# Altium project Iot_Flatform_Analog.PrjPcb
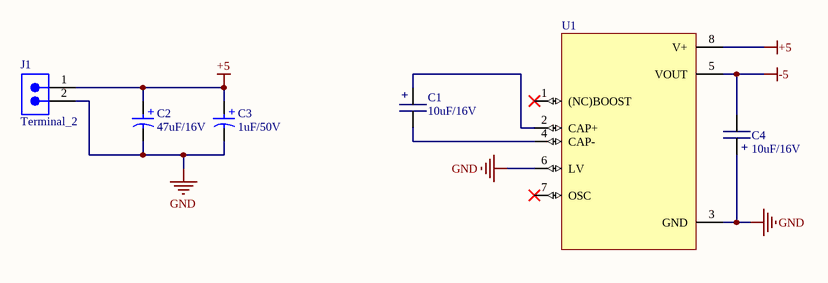
[diagram p0: Power_Supply.SchDoc]
6 sheets, 105 parts. Net scope: flat (ports and power ports of the same name join across sheets).
Board file: Test_AnalogPCB.PcbDoc
Sheets:
  Power_Supply.SchDoc
  MCU_STM32.SchDoc
  DAC.SchDoc
  Voltage_Ref.SchDoc
  Analog_input.SchDoc
  Analog_output.SchDoc

## Sheet Power_Supply.SchDoc
size A; SheetNumber: 1; SheetTotal: 4

### Parts
C1  10uF/16V  [TANTALUM SMD C]
C2  47uF/16V  [WCAP-ASLI_D5H5.5]
C3  1uF/50V  [WCAP-ASLI_D5H5.5]
C4  10uF/16V  [TANTALUM SMD C]
J1  Terminal_2  [TBL_2_3_81]
U1  (no value)  [SOIC127P600X175-8N]

### Nets
+5: C2.1(P) C3.1(P) J1.1 U1.8(V+)
-5: C4.1 U1.5(VOUT)
GND: C2.2(N) C3.2(N) C4.2 J1.2 U1.3(GND) U1.6(LV)
NetC1_1: C1.1 U1.4(CAP-)
NetC1_2: C1.2 U1.2(CAP+)

Not connected (* = marked no-connect by the designer): U1 1((NC)BOOST)* 7(OSC)*

### Notes on the sheet
- (in symbol Capacitor_Polarized_AL) +
- (in symbol Capacitor_Polarized_TA) +

### Library data of the parts
C1 C4 = Capacitor_Polarized_TA: Size: 2312; URL: https://www.thegioiic.com/tu-tantalum-10uf-16v-2312-tajc106k016rnj; Value: 10uF/16V
C2 C3 = Capacitor_Polarized_AL
  C2: Size: 5x5.4mm; URL: https://www.thegioiic.com/tu-nhom-smd-47uf-16v-5x5-4mm; Value: 47uF/16V
  C3: Size: 4x5.4mm; URL: https://www.thegioiic.com/tu-nhom-smd-1uf-50v-4x5-4mm; Value: 1uF/50V
J1 = Terminal_2: Value: 20A, 300V
U1 = ICL7662CBA-T: Size: 8-SOIC; Value: ICL7662CBA; URL: https://www.thegioiic.com/icl7662cba

## Sheet MCU_STM32.SchDoc
size A; SheetNumber: 2; SheetTotal: 11
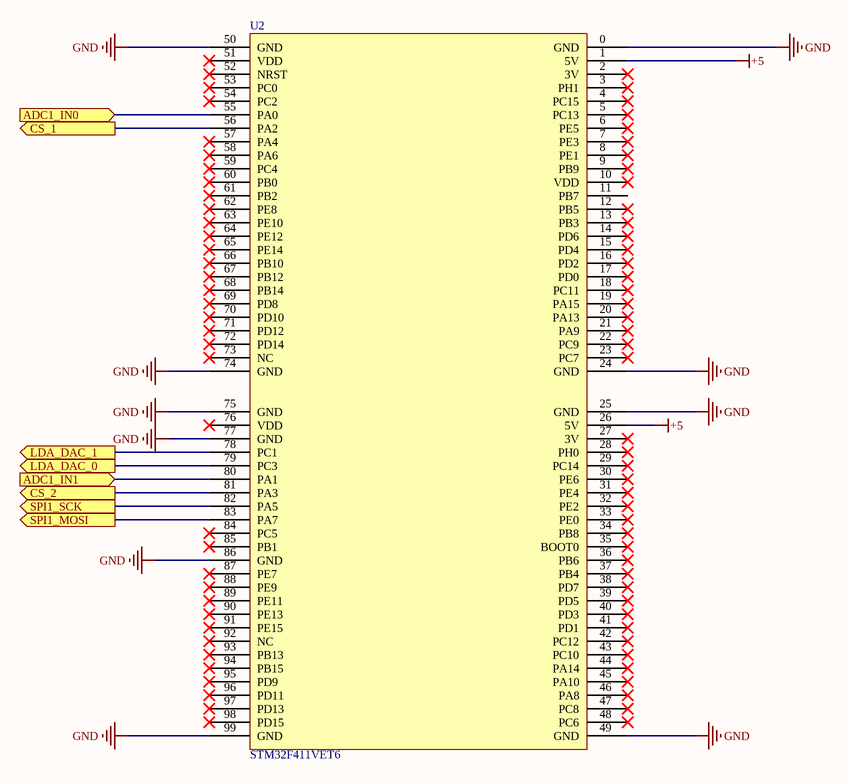
[diagram p1: MCU_STM32.SchDoc]

### Parts
U2  STM32F411VET6  [STM32F4]

### Ports
ADC1_IN0 (in), ADC1_IN1 (in), CS_1 (out), CS_2 (out), LDA_DAC_0 (out), LDA_DAC_1 (out), SPI1_MOSI (out), SPI1_SCK (out)

### Nets
+5: U2.1(5V) U2.26(5V)
GND: U2.0(GND) U2.24(GND) U2.25(GND) U2.49(GND) U2.50(GND) U2.74(GND) U2.75(GND) U2.77(GND) U2.86(GND) U2.99(GND)
NetR2_2: U2.55(PA0) ; port ADC1_IN0
NetR19_2: U2.80(PA1) ; port ADC1_IN1
NetU2_56: U2.56(PA2) ; port CS_1
NetU2_78: U2.78(PC1) ; port LDA_DAC_1
NetU2_79: U2.79(PC3) ; port LDA_DAC_0
NetU2_81: U2.81(PA3) ; port CS_2
NetU2_82: U2.82(PA5) ; port SPI1_SCK
NetU2_83: U2.83(PA7) ; port SPI1_MOSI

Not connected (* = marked no-connect by the designer): U2 2(3V)* 3(PH1)* 4(PC15)* 5(PC13)* 6(PE5)* 7(PE3)* 8(PE1)* 9(PB9)* 10(VDD)* 11(PB7) 12(PB5)* 13(PB3)* 14(PD6)* 15(PD4)* 16(PD2)* 17(PD0)* 18(PC11)* 19(PA15)* 20(PA13)* 21(PA9)* 22(PC9)* 23(PC7)* 27(3V)* 28(PH0)* 29(PC14)* 30(PE6)* 31(PE4)* 32(PE2)* 33(PE0)* 34(PB8)* 35(BOOT0)* 36(PB6)* 37(PB4)* 38(PD7)* 39(PD5)* 40(PD3)* 41(PD1)* 42(PC12)* 43(PC10)* 44(PA14)* 45(PA10)* 46(PA8)* 47(PC8)* 48(PC6)* 51(VDD)* 52(NRST)* 53(PC0)* 54(PC2)* 57(PA4)* 58(PA6)* 59(PC4)* 60(PB0)* 61(PB2)* 62(PE8)* 63(PE10)* 64(PE12)* 65(PE14)* 66(PB10)* 67(PB12)* 68(PB14)* 69(PD8)* 70(PD10)* 71(PD12)* 72(PD14)* 73(NC)* 76(VDD)* 84(PC5)* 85(PB1)* 87(PE7)* 88(PE9)* 89(PE11)* 90(PE13)* 91(PE15)* 92(NC)* 93(PB13)* 94(PB15)* 95(PD9)* 96(PD11)* 97(PD13)* 98(PD15)*

## Sheet DAC.SchDoc
size A; SheetNumber: 3; SheetTotal: 6
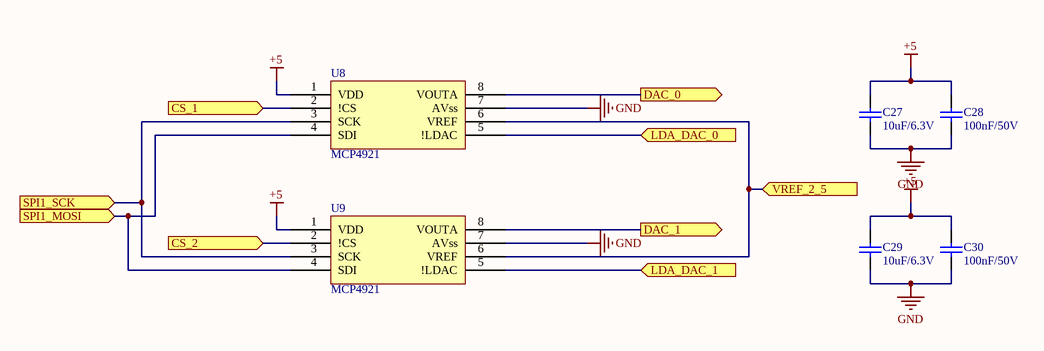
[diagram p2: DAC.SchDoc]

### Parts
C27  10uF/6.3V  [CAP_0805]
C28  100nF/50V  [CAP_0805]
C29  10uF/6.3V  [CAP_0805]
C30  100nF/50V  [CAP_0805]
U8  MCP4921  [SOIC127P600X175-8N]
U9  MCP4921  [SOIC127P600X175-8N]

### Ports
CS_1 (in), CS_2 (in), DAC_0 (out), DAC_1 (out), LDA_DAC_0 (in), LDA_DAC_1 (in), SPI1_MOSI (in), SPI1_SCK (in), VREF_2_5 (in)

### Nets
+5: C27.2 C28.2 C29.2 C30.2 U8.1(VDD) U9.1(VDD)
GND: C27.1 C28.1 C29.1 C30.1 U8.7(AVss) U9.7(AVss)
NetC48_2: U8.6(VREF) U9.6(VREF) ; port VREF_2_5
NetR9_1: U8.8(VOUTA) ; port DAC_0
NetR23_1: U9.8(VOUTA) ; port DAC_1
NetU2_56: U8.2(!CS) ; port CS_1
NetU2_78: U9.5(!LDAC) ; port LDA_DAC_1
NetU2_79: U8.5(!LDAC) ; port LDA_DAC_0
NetU2_81: U9.2(!CS) ; port CS_2
NetU2_82: U8.3(SCK) U9.3(SCK) ; port SPI1_SCK
NetU2_83: U8.4(SDI) U9.4(SDI) ; port SPI1_MOSI

### Library data of the parts
C27-C30 = Capacitor: Size: 0805
  C27 C29: URL: https://www.thegioiic.com/tu-gom-0805-10uf-6-3v; Value: 10uF/6.3V
  C28 C30: URL: https://www.thegioiic.com/tu-gom-0805-100nf-0-1uf-50v; Value: 100nF/50V
U8 U9 = MCP4921: Interface SPI; Value: MCP4921-E/SN; Size: 8-SOIC; URL: https://www.thegioiic.com/mcp4921-e-sn-ic-dac-12-bit-1-channel-8-soic

## Sheet Voltage_Ref.SchDoc
size A; SheetNumber: 4; SheetTotal: 6
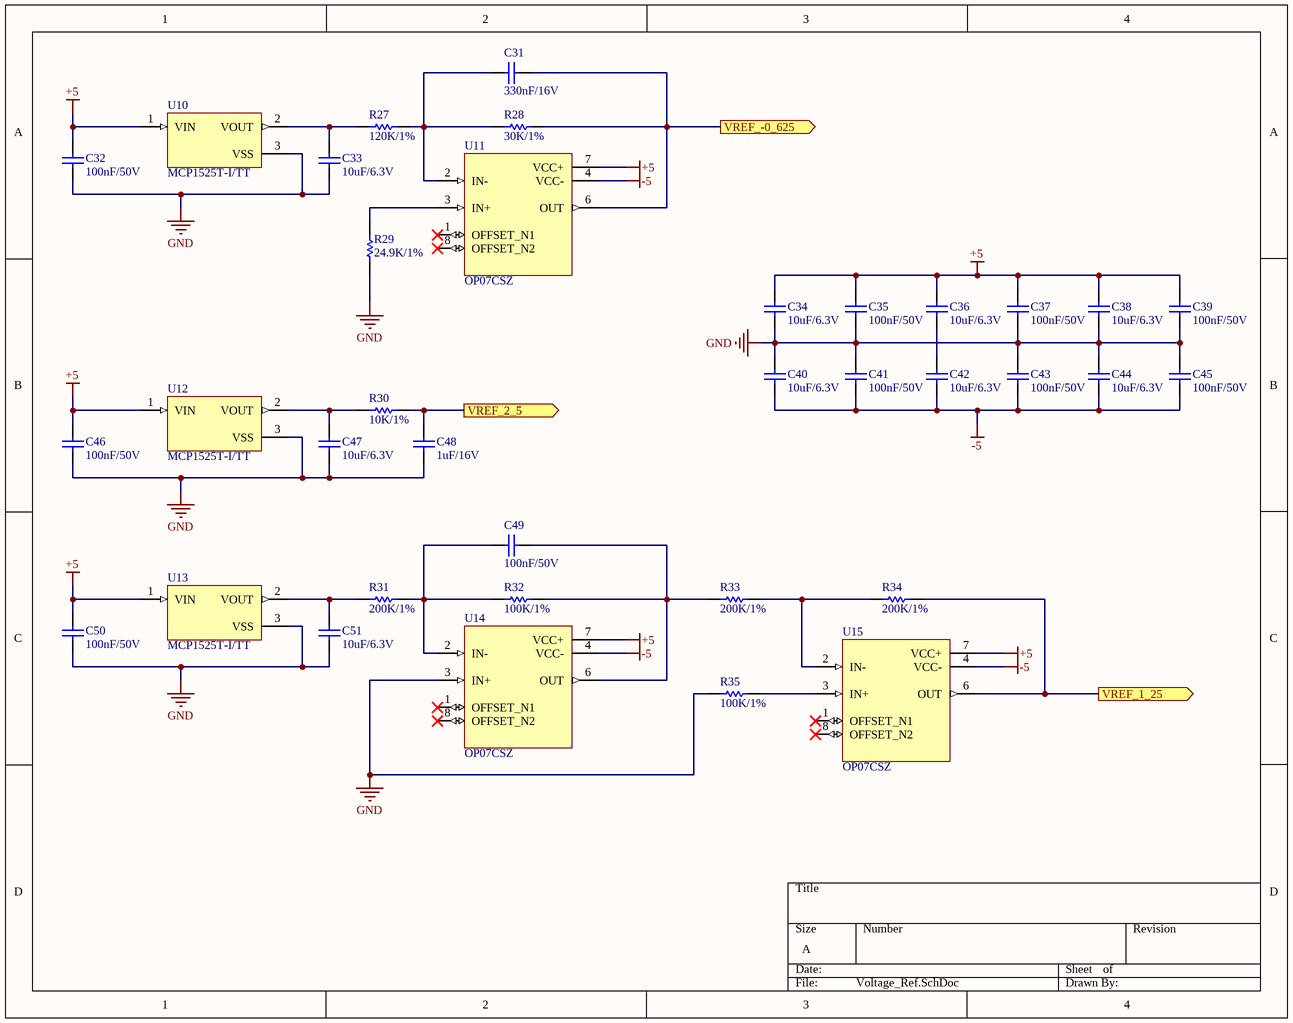
[diagram p3: Voltage_Ref.SchDoc]

### Parts
C31  330nF/16V  [CAP_0805]
C32  100nF/50V  [CAP_0805]
C33  10uF/6.3V  [CAP_0805]
C34  10uF/6.3V  [CAP_0805]
C35  100nF/50V  [CAP_0805]
C36  10uF/6.3V  [CAP_0805]
C37  100nF/50V  [CAP_0805]
C38  10uF/6.3V  [CAP_0805]
C39  100nF/50V  [CAP_0805]
C40  10uF/6.3V  [CAP_0805]
C41  100nF/50V  [CAP_0805]
C42  10uF/6.3V  [CAP_0805]
C43  100nF/50V  [CAP_0805]
C44  10uF/6.3V  [CAP_0805]
C45  100nF/50V  [CAP_0805]
C46  100nF/50V  [CAP_0805]
C47  10uF/6.3V  [CAP_0805]
C48  1uF/16V  [CAP_0805]
C49  100nF/50V  [CAP_0805]
C50  100nF/50V  [CAP_0805]
C51  10uF/6.3V  [CAP_0805]
R27  120K/1%  [RES_0805]
R28  30K/1%  [RES_0805]
R29  24.9K/1%  [RES_0805]
R30  10K/1%  [RES_0805]
R31  200K/1%  [RES_0805]
R32  100K/1%  [RES_0805]
R33  200K/1%  [RES_0805]
R34  200K/1%  [RES_0805]
R35  100K/1%  [RES_0805]
U10  MCP1525T-I/TT  [SOT95P237X112-3N]
U11  OP07CSZ  [SOIC127P600X175-8N]
U12  MCP1525T-I/TT  [SOT95P237X112-3N]
U13  MCP1525T-I/TT  [SOT95P237X112-3N]
U14  OP07CSZ  [SOIC127P600X175-8N]
U15  OP07CSZ  [SOIC127P600X175-8N]

### Ports
VREF_1_25 (out), VREF_2_5 (out), VREF_-0_625 (out)

### Nets
+5: C32.2 C34.2 C35.2 C36.2 C37.2 C38.2 C39.2 C46.2 C50.2 U10.1(VIN) U11.7(VCC+) U12.1(VIN) U13.1(VIN) U14.7(VCC+) U15.7(VCC+)
-5: C40.1 C41.1 C42.1 C43.1 C44.1 C45.1 U11.4(VCC-) U14.4(VCC-) U15.4(VCC-)
GND: C32.1 C33.1 C34.1 C35.1 C37.1 C38.1 C39.1 C40.2 C41.2 C43.2 C44.2 C45.2 C46.1 C47.1 C48.1 C50.1 C51.1 R29.1 R35.1 U10.3(VSS) U12.3(VSS) U13.3(VSS) U14.3(IN+)
NetC31_1: C31.1 R28.2 U11.6(OUT) ; port VREF_-0_625
NetC31_2: C31.2 R27.2 R28.1 U11.2(IN-)
NetC33_2: C33.2 R27.1 U10.2(VOUT)
NetC36_1: C36.1 C42.2
NetC47_2: C47.2 R30.2 U12.2(VOUT)
NetC48_2: C48.2 R30.1 ; port VREF_2_5
NetC49_1: C49.1 R32.2 R33.1 U14.6(OUT)
NetC49_2: C49.2 R31.2 R32.1 U14.2(IN-)
NetC51_2: C51.2 R31.1 U13.2(VOUT)
NetR25_1: R34.2 U15.6(OUT) ; port VREF_1_25
NetR29_2: R29.2 U11.3(IN+)
NetR33_2: R33.2 R34.1 U15.2(IN-)
NetR35_2: R35.2 U15.3(IN+)

Not connected (* = marked no-connect by the designer): U11 1(OFFSET_N1)* 8(OFFSET_N2)*; U14 1(OFFSET_N1)* 8(OFFSET_N2)*; U15 1(OFFSET_N1)* 8(OFFSET_N2)*

### Library data of the parts
C31-C51 = Capacitor: Size: 0805
  C31: URL: https://www.thegioiic.com/tu-gom-0805-330nf-16v; Value: 330nF/16V
  C32 C35 C37 C39 C41 C43 C45 C46 C49 C50: URL: https://www.thegioiic.com/tu-gom-0805-100nf-0-1uf-50v; Value: 100nF/50V
  C33 C34 C36 C38 C40 C42 C44 C47 C51: URL: https://www.thegioiic.com/tu-gom-0805-10uf-6-3v; Value: 10uF/6.3V
  C48: URL: https://www.thegioiic.com/tu-gom-0805-1uf-16v; Value: 1uF/16V
R27-R35 = Resistor: Size: 0805
  R27: URL: https://www.thegioiic.com/dien-tro-120-kohm-0805-1-; Value: 120K/1%
  R28: URL: https://www.thegioiic.com/dien-tro-30-kohm-0805-1-; Value: 30K/1%
  R29: URL: https://www.thegioiic.com/dien-tro-24-9-kohm-0805-1-; Value: 24.9K/1%
  R30: URL: https://www.thegioiic.com/dien-tro-10-kohm-0805-1-; Value: 10K/1%
  R31 R33 R34: URL: https://www.thegioiic.com/dien-tro-200-kohm-0805-1-; Value: 200K/1%
  R32 R35: URL: https://www.thegioiic.com/dien-tro-100-kohm-0805-1-; Value: 100K/1%
U10 U12 U13 = MCP1525T-I/TT: Series Voltage Reference IC Â±1% SOT-23-3; Value: 2.5VDC; Size: SOT-23; URL: https://www.thegioiic.com/mcp1525t-i-tt-ic-tham-chieu-dien-ap-2-5v-sot-23
U11 U14 U15 = OP07CSZ: Low-Offset Voltage Operational Amplifier; Size: 8-SOIC; URL: https://www.thegioiic.com/op07csz-ic-opamp-general-purpose-amplifier-1-circuit-600khz-8-soic; Value: OP07CSZ

## Sheet Analog_input.SchDoc
size A; SheetNumber: 5; SheetTotal: 6
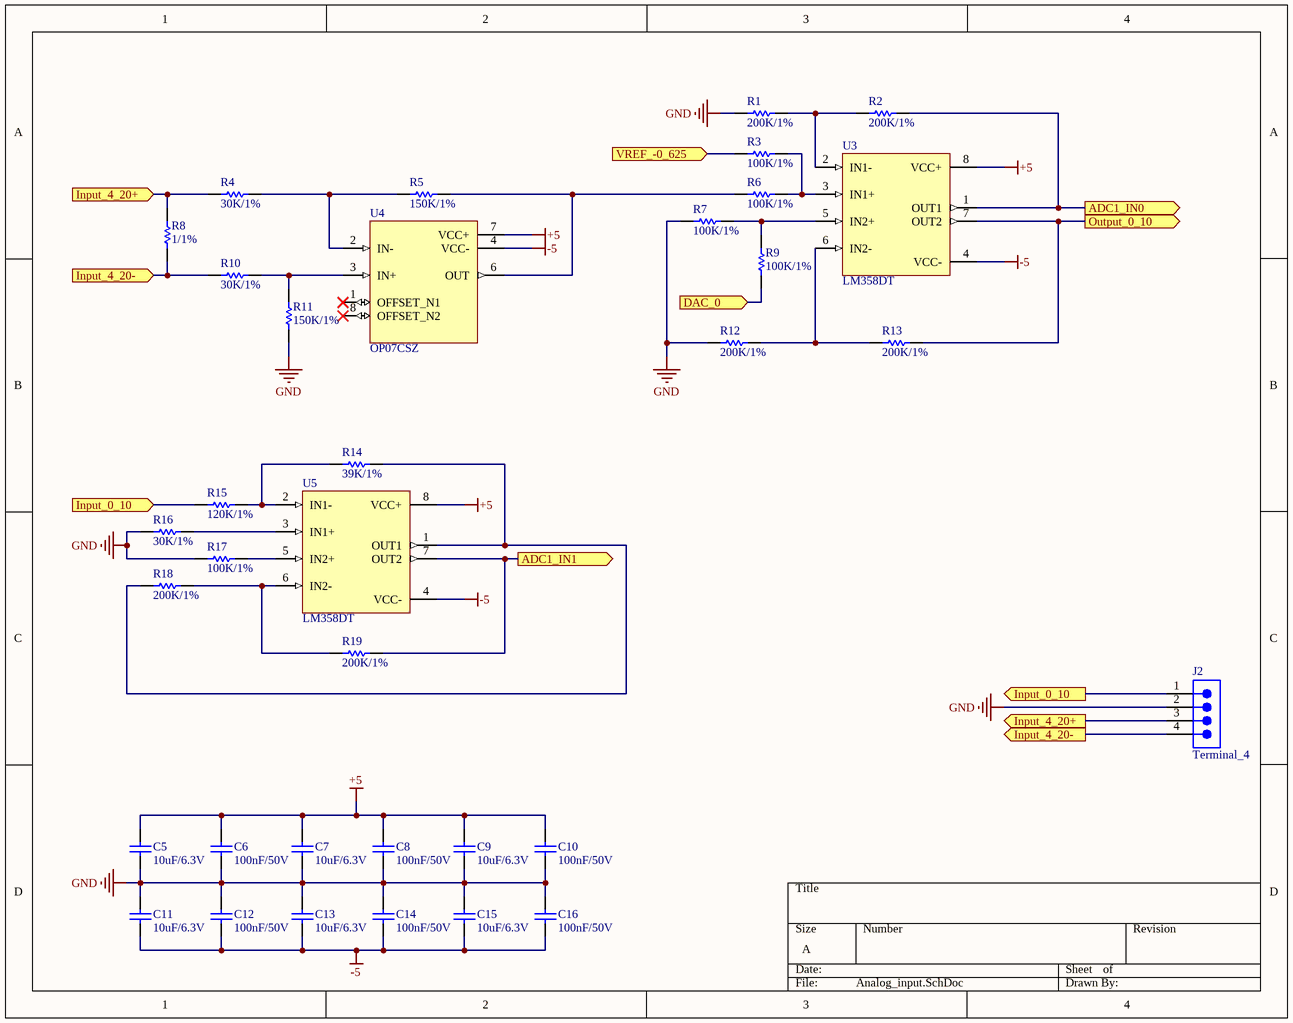
[diagram p4: Analog_input.SchDoc]

### Parts
C5  10uF/6.3V  [CAP_0805]
C6  100nF/50V  [CAP_0805]
C7  10uF/6.3V  [CAP_0805]
C8  100nF/50V  [CAP_0805]
C9  10uF/6.3V  [CAP_0805]
C10  100nF/50V  [CAP_0805]
C11  10uF/6.3V  [CAP_0805]
C12  100nF/50V  [CAP_0805]
C13  10uF/6.3V  [CAP_0805]
C14  100nF/50V  [CAP_0805]
C15  10uF/6.3V  [CAP_0805]
C16  100nF/50V  [CAP_0805]
J2  Terminal_4  [TBL_4_3_81]
R1  200K/1%  [RES_0805]
R2  200K/1%  [RES_0805]
R3  100K/1%  [RES_0805]
R4  30K/1%  [RES_0805]
R5  150K/1%  [RES_0603]
R6  100K/1%  [RES_0805]
R7  100K/1%  [RES_0805]
R8  1/1%  [RES_0805]
R9  100K/1%  [RES_0805]
R10  30K/1%  [RES_0805]
R11  150K/1%  [RES_0805]
R12  200K/1%  [RES_0805]
R13  200K/1%  [RES_0805]
R14  39K/1%  [RES_0805]
R15  120K/1%  [RES_0805]
R16  30K/1%  [RES_0805]
R17  100K/1%  [RES_0805]
R18  200K/1%  [RES_0805]
R19  200K/1%  [RES_0805]
U3  LM358DT  [SOIC127P600X175-8N]
U4  OP07CSZ  [SOIC127P600X175-8N]
U5  LM358DT  [SOIC127P600X175-8N]

### Ports
ADC1_IN0 (out), ADC1_IN1 (out), DAC_0 (in), Input_0_10 (in), Input_0_10 (out), Input_4_20+ (in), Input_4_20+ (out), Input_4_20- (in), Input_4_20- (out), Output_0_10 (out), VREF_-0_625 (in)

### Nets
+5: C5.2 C6.2 C7.2 C8.2 C9.2 C10.2 U3.8(VCC+) U4.7(VCC+) U5.8(VCC+)
-5: C11.1 C12.1 C13.1 C14.1 C15.1 C16.1 U3.4(VCC-) U4.4(VCC-) U5.4(VCC-)
GND: C5.1 C6.1 C7.1 C8.1 C9.1 C10.1 C11.2 C12.2 C13.2 C14.2 C15.2 C16.2 J2.2 R1.1 R7.1 R11.1 R12.1 R16.1 R17.1
NetC31_1: R3.1 ; port VREF_-0_625
NetJ2_1: J2.1 R15.1 ; port Input_0_10
NetJ2_3: J2.3 R4.1 R8.2 ; port Input_4_20+
NetJ2_4: J2.4 R8.1 R10.1 ; port Input_4_20-
NetJ3_1: R13.2 U3.7(OUT2) ; port Output_0_10
NetR1_2: R1.2 R2.1 U3.2(IN1-)
NetR2_2: R2.2 U3.1(OUT1) ; port ADC1_IN0
NetR3_2: R3.2 R6.2 U3.3(IN1+)
NetR4_2: R4.2 R5.1 U4.2(IN-)
NetR5_2: R5.2 R6.1 U4.6(OUT)
NetR7_2: R7.2 R9.2 U3.5(IN2+)
NetR9_1: R9.1 ; port DAC_0
NetR10_2: R10.2 R11.2 U4.3(IN+)
NetR12_2: R12.2 R13.1 U3.6(IN2-)
NetR14_1: R14.1 R15.2 U5.2(IN1-)
NetR14_2: R14.2 R18.1 U5.1(OUT1)
NetR16_2: R16.2 U5.3(IN1+)
NetR17_2: R17.2 U5.5(IN2+)
NetR18_2: R18.2 R19.1 U5.6(IN2-)
NetR19_2: R19.2 U5.7(OUT2) ; port ADC1_IN1

Not connected (* = marked no-connect by the designer): U4 1(OFFSET_N1)* 8(OFFSET_N2)*

### Library data of the parts
C5-C16 = Capacitor: Size: 0805
  C5 C7 C9 C11 C13 C15: URL: https://www.thegioiic.com/tu-gom-0805-10uf-6-3v; Value: 10uF/6.3V
  C6 C8 C10 C12 C14 C16: URL: https://www.thegioiic.com/tu-gom-0805-100nf-0-1uf-50v; Value: 100nF/50V
J2 = Terminal_4: Value: 20A, 300V
R1-R19 = Resistor: Size: 0805
  R1 R2 R12 R13 R18 R19: URL: https://www.thegioiic.com/dien-tro-200-kohm-0805-1-; Value: 200K/1%
  R3 R6 R7 R9 R17: URL: https://www.thegioiic.com/dien-tro-100-kohm-0805-1-; Value: 100K/1%
  R4 R10 R16: URL: https://www.thegioiic.com/dien-tro-30-kohm-0805-1-; Value: 30K/1%
  R5 R11: URL: https://www.thegioiic.com/dien-tro-150-kohm-0805-1-; Value: 150K/1%
  R8: URL: https://www.thegioiic.com/dien-tro-1-ohm-0805-1-https://www.thegioiic.com/dien-tro-1-ohm-0805-1-; Value: 1/1%
  R14: URL: https://www.thegioiic.com/dien-tro-39-kohm-0805-1-; Value: 39K/1%
  R15: URL: https://www.thegioiic.com/dien-tro-120-kohm-0805-1-; Value: 120K/1%
U3 U5 = LM358DT: General Purpose Amplifier 2 Circuit 8-SO; Size: 8-SOIC; URL: https://www.thegioiic.com/lm358dt-ic-opamp-general-purpose-amplifier-2-circuit-1-1mhz-8-soic; Value: LM358DT
U4 = OP07CSZ: Low-Offset Voltage Operational Amplifier; Size: 8-SOIC; URL: https://www.thegioiic.com/op07csz-ic-opamp-general-purpose-amplifier-1-circuit-600khz-8-soic; Value: OP07CSZ

## Sheet Analog_output.SchDoc
size A; SheetNumber: 6; SheetTotal: 6
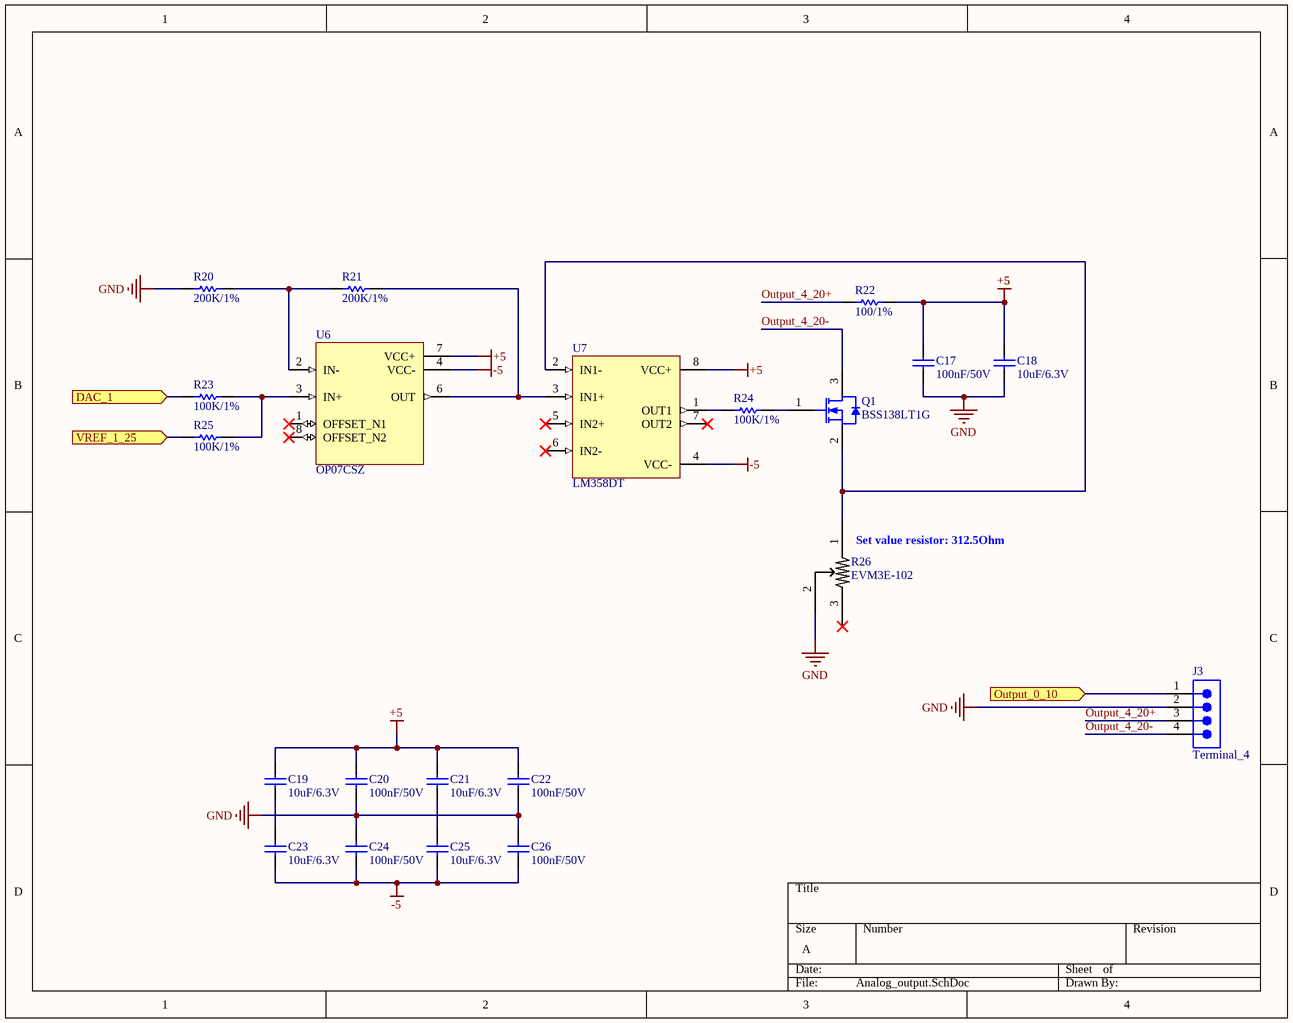
[diagram p5: Analog_output.SchDoc]

### Parts
C17  100nF/50V  [CAP_0805]
C18  10uF/6.3V  [CAP_0805]
C19  10uF/6.3V  [CAP_0805]
C20  100nF/50V  [CAP_0805]
C21  10uF/6.3V  [CAP_0805]
C22  100nF/50V  [CAP_0805]
C23  10uF/6.3V  [CAP_0805]
C24  100nF/50V  [CAP_0805]
C25  10uF/6.3V  [CAP_0805]
C26  100nF/50V  [CAP_0805]
J3  Terminal_4  [TBL_4_3_81]
Q1  BSS138LT1G  [SQ2398ES-SOT23]
R20  200K/1%  [RES_0805]
R21  200K/1%  [RES_0805]
R22  100/1%  [RES_0805]
R23  100K/1%  [RES_0805]
R24  100K/1%  [RES_0805]
R25  100K/1%  [RES_0805]
R26  EVM3E-102  [EVM3E]
U6  OP07CSZ  [SOIC127P600X175-8N]
U7  LM358DT  [SOIC127P600X175-8N]

### Ports
DAC_1 (in), Output_0_10 (in), VREF_1_25 (in)

### Nets
+5: C17.2 C18.2 C19.2 C20.2 C21.2 C22.2 R22.2 U6.7(VCC+) U7.8(VCC+)
-5: C23.1 C24.1 C25.1 C26.1 U6.4(VCC-) U7.4(VCC-)
GND: C17.1 C18.1 C20.1 C22.1 C24.2 C26.2 J3.2 R20.1 R26.2
Output_4_20+: J3.3 R22.1
Output_4_20-: J3.4 Q1.3(D)
NetC19_1: C19.1 C23.2
NetC21_1: C21.1 C25.2
NetJ3_1: J3.1 ; port Output_0_10
NetQ1_1: Q1.1(G) R24.2
NetQ1_2: Q1.2(S) R26.1 U7.2(IN1-)
NetR20_2: R20.2 R21.1 U6.2(IN-)
NetR21_2: R21.2 U6.6(OUT) U7.3(IN1+)
NetR23_1: R23.1 ; port DAC_1
NetR23_2: R23.2 R25.2 U6.3(IN+)
NetR24_1: R24.1 U7.1(OUT1)
NetR25_1: R25.1 ; port VREF_1_25

Not connected (* = marked no-connect by the designer): R26 3*; U6 1(OFFSET_N1)* 8(OFFSET_N2)*; U7 5(IN2+)* 6(IN2-)* 7(OUT2)*

### Notes on the sheet
- (near R26) Set value resistor: 312.5Ohm

### Library data of the parts
C17-C26 = Capacitor: Size: 0805
  C17 C20 C22 C24 C26: URL: https://www.thegioiic.com/tu-gom-0805-100nf-0-1uf-50v; Value: 100nF/50V
  C18 C19 C21 C23 C25: URL: https://www.thegioiic.com/tu-gom-0805-10uf-6-3v; Value: 10uF/6.3V
J3 = Terminal_4: Value: 20A, 300V
Q1 = BSS138LT1G: BSS138LT1G, MOSFET, N ,50V, 200mA ,SOT-23; Size: SOT-23; URL: https://www.thegioiic.com/bss138lt1g-mosfet-kenh-n-50v-200ma-sot-23?gidzl=ejQjBwD9gJIgoweegb-XEgd0foIs3Qmxv9EgAUq7gMEvcFujlbAkFktE-2NgLAvjwy6k8Z0nh38heKYfCm; Value: BSS138LT1G
R20-R25 = Resistor: Size: 0805
  R20 R21: URL: https://www.thegioiic.com/dien-tro-200-kohm-0805-1-; Value: 200K/1%
  R22: URL: https://www.thegioiic.com/dien-tro-100-kohm-0805-1-; Value: 100/1%
  R23-R25: URL: https://www.thegioiic.com/dien-tro-100-kohm-0805-1-; Value: 100K/1%
R26 = EVM3E-102: 1KOhm, 0.15W,  ±20%, EVM3E; URL: https://www.thegioiic.com/evm3e-102-bien-tro-1-kohm-nut-ao-smd-0-15w; Value: EVM3E-102; Size: EVM3E
U6 = OP07CSZ: Low-Offset Voltage Operational Amplifier; Size: 8-SOIC; URL: https://www.thegioiic.com/op07csz-ic-opamp-general-purpose-amplifier-1-circuit-600khz-8-soic; Value: OP07CSZ
U7 = LM358DT: General Purpose Amplifier 2 Circuit 8-SO; Size: 8-SOIC; URL: https://www.thegioiic.com/lm358dt-ic-opamp-general-purpose-amplifier-2-circuit-1-1mhz-8-soic; Value: LM358DT

## Nets that join several sheets
+5: Power_Supply (C2.1 C3.1 J1.1 U1.8), MCU_STM32 (U2.1 U2.26), DAC (6 pins), Voltage_Ref (15 pins), Analog_input (9 pins), Analog_output (9 pins)
-5: Power_Supply (C4.1 U1.5), Voltage_Ref (9 pins), Analog_input (9 pins), Analog_output (6 pins)
GND: Power_Supply (6 pins), MCU_STM32 (10 pins), DAC (6 pins), Voltage_Ref (23 pins), Analog_input (19 pins), Analog_output (9 pins)
NetC31_1: Voltage_Ref (C31.1 R28.2 U11.6), Analog_input (R3.1)
NetC48_2: DAC (U8.6 U9.6), Voltage_Ref (C48.2 R30.1)
NetJ3_1: Analog_input (R13.2 U3.7), Analog_output (J3.1)
NetR2_2: MCU_STM32 (U2.55), Analog_input (R2.2 U3.1)
NetR9_1: DAC (U8.8), Analog_input (R9.1)
NetR19_2: MCU_STM32 (U2.80), Analog_input (R19.2 U5.7)
NetR23_1: DAC (U9.8), Analog_output (R23.1)
NetR25_1: Voltage_Ref (R34.2 U15.6), Analog_output (R25.1)
NetU2_56: MCU_STM32 (U2.56), DAC (U8.2)
NetU2_78: MCU_STM32 (U2.78), DAC (U9.5)
NetU2_79: MCU_STM32 (U2.79), DAC (U8.5)
NetU2_81: MCU_STM32 (U2.81), DAC (U9.2)
NetU2_82: MCU_STM32 (U2.82), DAC (U8.3 U9.3)
NetU2_83: MCU_STM32 (U2.83), DAC (U8.4 U9.4)